# EAGLE schematic uknc_fdd2sd_rev1 (EAGLE 7.7.0)
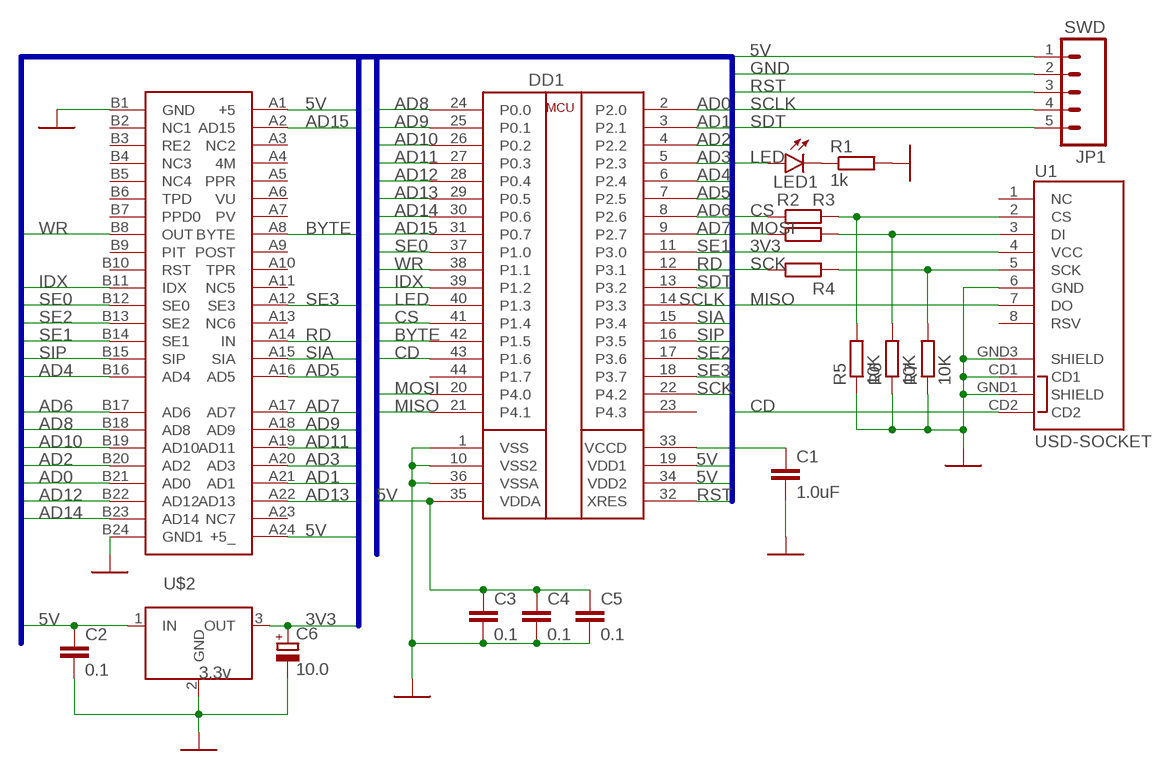
[diagram p0: schematic, sheet 1]

## Parts
C1  1.0uF  1.0UF-25V-+80/-20(0805)"  [0805-CAP]
C2  0.1  C-EUC0805  [C0805]
C3  0.1  C-EUC0805  [C0805]
C4  0.1  C-EUC0805  [C0805]
C5  0.1  C-EUC0805  [C0805]
C6  10.0  CPOL-EUE1.8-4  [E1,8-4]
DD1  CY8C4245AXI  [TQFP-44]
JP1  SWD  M05PTH  [1X05]
LED1  LED1206  [LED-1206]
R1  1k  R-EU_R0805  [R0805]
R2  R-EU_R0805  [R0805]
R3  R-EU_R0805  [R0805]
R4  R-EU_R0805  [R0805]
R5  10K  R-EU_M0805  [M0805]
R6  10K  R-EU_M0805  [M0805]
R7  10K  R-EU_M0805  [M0805]
U1  USD-SOCKET  [MICROSD_1:1]
U$1  SNP  [SNP15-48-BOARD]
U$2  3.3v  1235B  [1235B]

## Nets
3V3: C6.+ U1.4(VCC) U$2.3(OUT)
5V: C2.1 C3.1 C4.1 C5.1 DD1.19(VDD1) DD1.34(VDD2) DD1.35(VDDA) JP1.1 U$1.A1(+5) U$1.A24(+5_) U$2.1(IN)
AD0: DD1.2(P2.0) U$1.B21(AD0)
AD1: DD1.3(P2.1) U$1.A21(AD1)
AD2: DD1.4(P2.2) U$1.B20(AD2)
AD3: DD1.5(P2.3) U$1.A20(AD3)
AD4: DD1.6(P2.4) U$1.B16(AD4)
AD5: DD1.7(P2.5) U$1.A16(AD5)
AD6: DD1.8(P2.6) U$1.B17(AD6)
AD7: DD1.9(P2.7) U$1.A17(AD7)
AD8: DD1.24(P0.0) U$1.B18(AD8)
AD9: DD1.25(P0.1) U$1.A18(AD9)
AD10: DD1.26(P0.2) U$1.B19(AD10)
AD11: DD1.27(P0.3) U$1.A19(AD11)
AD12: DD1.28(P0.4) U$1.B22(AD12)
AD13: DD1.29(P0.5) U$1.A22(AD13)
AD14: DD1.30(P0.6) U$1.B23(AD14)
AD15: DD1.31(P0.7) U$1.A2(AD15)
BYTE: DD1.42(P1.5) U$1.A8(BYTE)
CD: DD1.43(P1.6) U1.CD2
CS: DD1.41(P1.4) R2.1
GND: C1.2 C2.2 C3.2 C4.2 C5.2 C6.- DD1.1(VSS) DD1.10(VSS2) DD1.36(VSSA) JP1.2 R1.2 R5.1 R6.1 R7.1 U1.6(GND) U1.CD1 U1.GND1(SHIELD) U1.GND3(SHIELD) U$1.B1(GND) U$1.B24(GND1) U$2.2(GND)
IDX: DD1.39(P1.2) U$1.B11(IDX)
LED: DD1.40(P1.3) LED1.A
MISO: DD1.21(P4.1) U1.7(DO)
MOSI: DD1.20(P4.0) R3.1
N$1: C1.1 DD1.33(VCCD)
N$3: LED1.C R1.1
N$4: R2.2 R5.2 U1.2(CS)
N$5: R3.2 R6.2 U1.3(DI)
N$6: R4.2 R7.2 U1.5(SCK)
RD: DD1.12(P3.1) U$1.A14(IN)
RST: DD1.32(XRES) JP1.3
SCK: DD1.22(P4.2) R4.1
SCLK: DD1.14(P3.3) JP1.4
SDT: DD1.13(P3.2) JP1.5
SE0: DD1.37(P1.0) U$1.B12(SE0)
SE1: DD1.11(P3.0) U$1.B14(SE1)
SE2: DD1.17(P3.6) U$1.B13(SE2)
SE3: DD1.18(P3.7) U$1.A12(SE3)
SIA: DD1.15(P3.4) U$1.A15(SIA)
SIP: DD1.16(P3.5) U$1.B15(SIP)
WR: DD1.38(P1.1) U$1.B8(OUT)
Unconnected: DD1.23(P4.3) DD1.44(P1.7) U1.1(NC) U1.8(RSV) U$1.A3(NC2) U$1.A4(4M) U$1.A5(PPR) U$1.A6(VU) U$1.A7(PV) U$1.A9(POST) U$1.A10(TPR) U$1.A11(NC5) U$1.A13(NC6) U$1.A23(NC7) U$1.B2(NC1) U$1.B3(RE2) U$1.B4(NC3) U$1.B5(NC4) U$1.B6(TPD) U$1.B7(PPD0) U$1.B9(PIT) U$1.B10(RST)

## Buses
B$1

## Library data of the parts
C1 = SparkFun-Capacitors:1.0UF-25V-+80/-20(0805): CAP-11625; PROD_ID: CAP-11625
C2-C5 = resistor:C-EU: CAPACITOR, European symbol
C6 = resistor:CPOL-EU: POLARIZED CAPACITOR, European symbol
DD1 = CYP:CY8C4245AXI: CY8C4245AXI IN TQFP-44 PACKAGE
JP1 = SparkFun-Connectors:M05: Header 5 Standard 5-pin 0.1" header. Use with straight break away headers (SKU : PRT-00116), right angle break away headers (PRT-00553), swiss pins (PRT-00743), machine pins (PRT-00117), and female headers (PRT-00115). Molex polarized connector foot print use with SKU : PRT-08230 with associated crimp pins and housings.
LED1 = SparkFun-LED:LED: LEDs Standard schematic elements and footprints for 5mm, 3mm, 1206, and 0603 sized LEDs. 5mm - Spark Fun Electronics SKU : COM-00529 (and others)
R1-R7 = resistor:R-EU_: RESISTOR, European symbol
U1 = SparkFun-Connectors:USD-SOCKET: microSD Socket Push-push type uSD socket. Schematic element and footprint production proven. Spark Fun Electronics SKU : PRT-00127. tDoc lines correctly indicate media card edge positions when inserting (unlocked, locked, depressed). NOTE: CD1 and CD2 are connected internally; PROD_ID: CONN-07820
U$1 = connectors:SNP
U$2 = stab:1235B: Belarussian 3.3v stabilizer